# EasyEDA Pro project 05_立创eda专业版_esp32语音助手-电池版_2024-09-18.epro

# Schematic esp32语音助手-电池版

## Sheets
1 esp32_mini: Board Name: 05_语音板-天问_电池; Create Date: 2024-08-17; Page Name: esp32_mini; Project Name: esp32语音助手-自制版; Schematic Name: Schematic1_3; Update Date: 2024-09-04
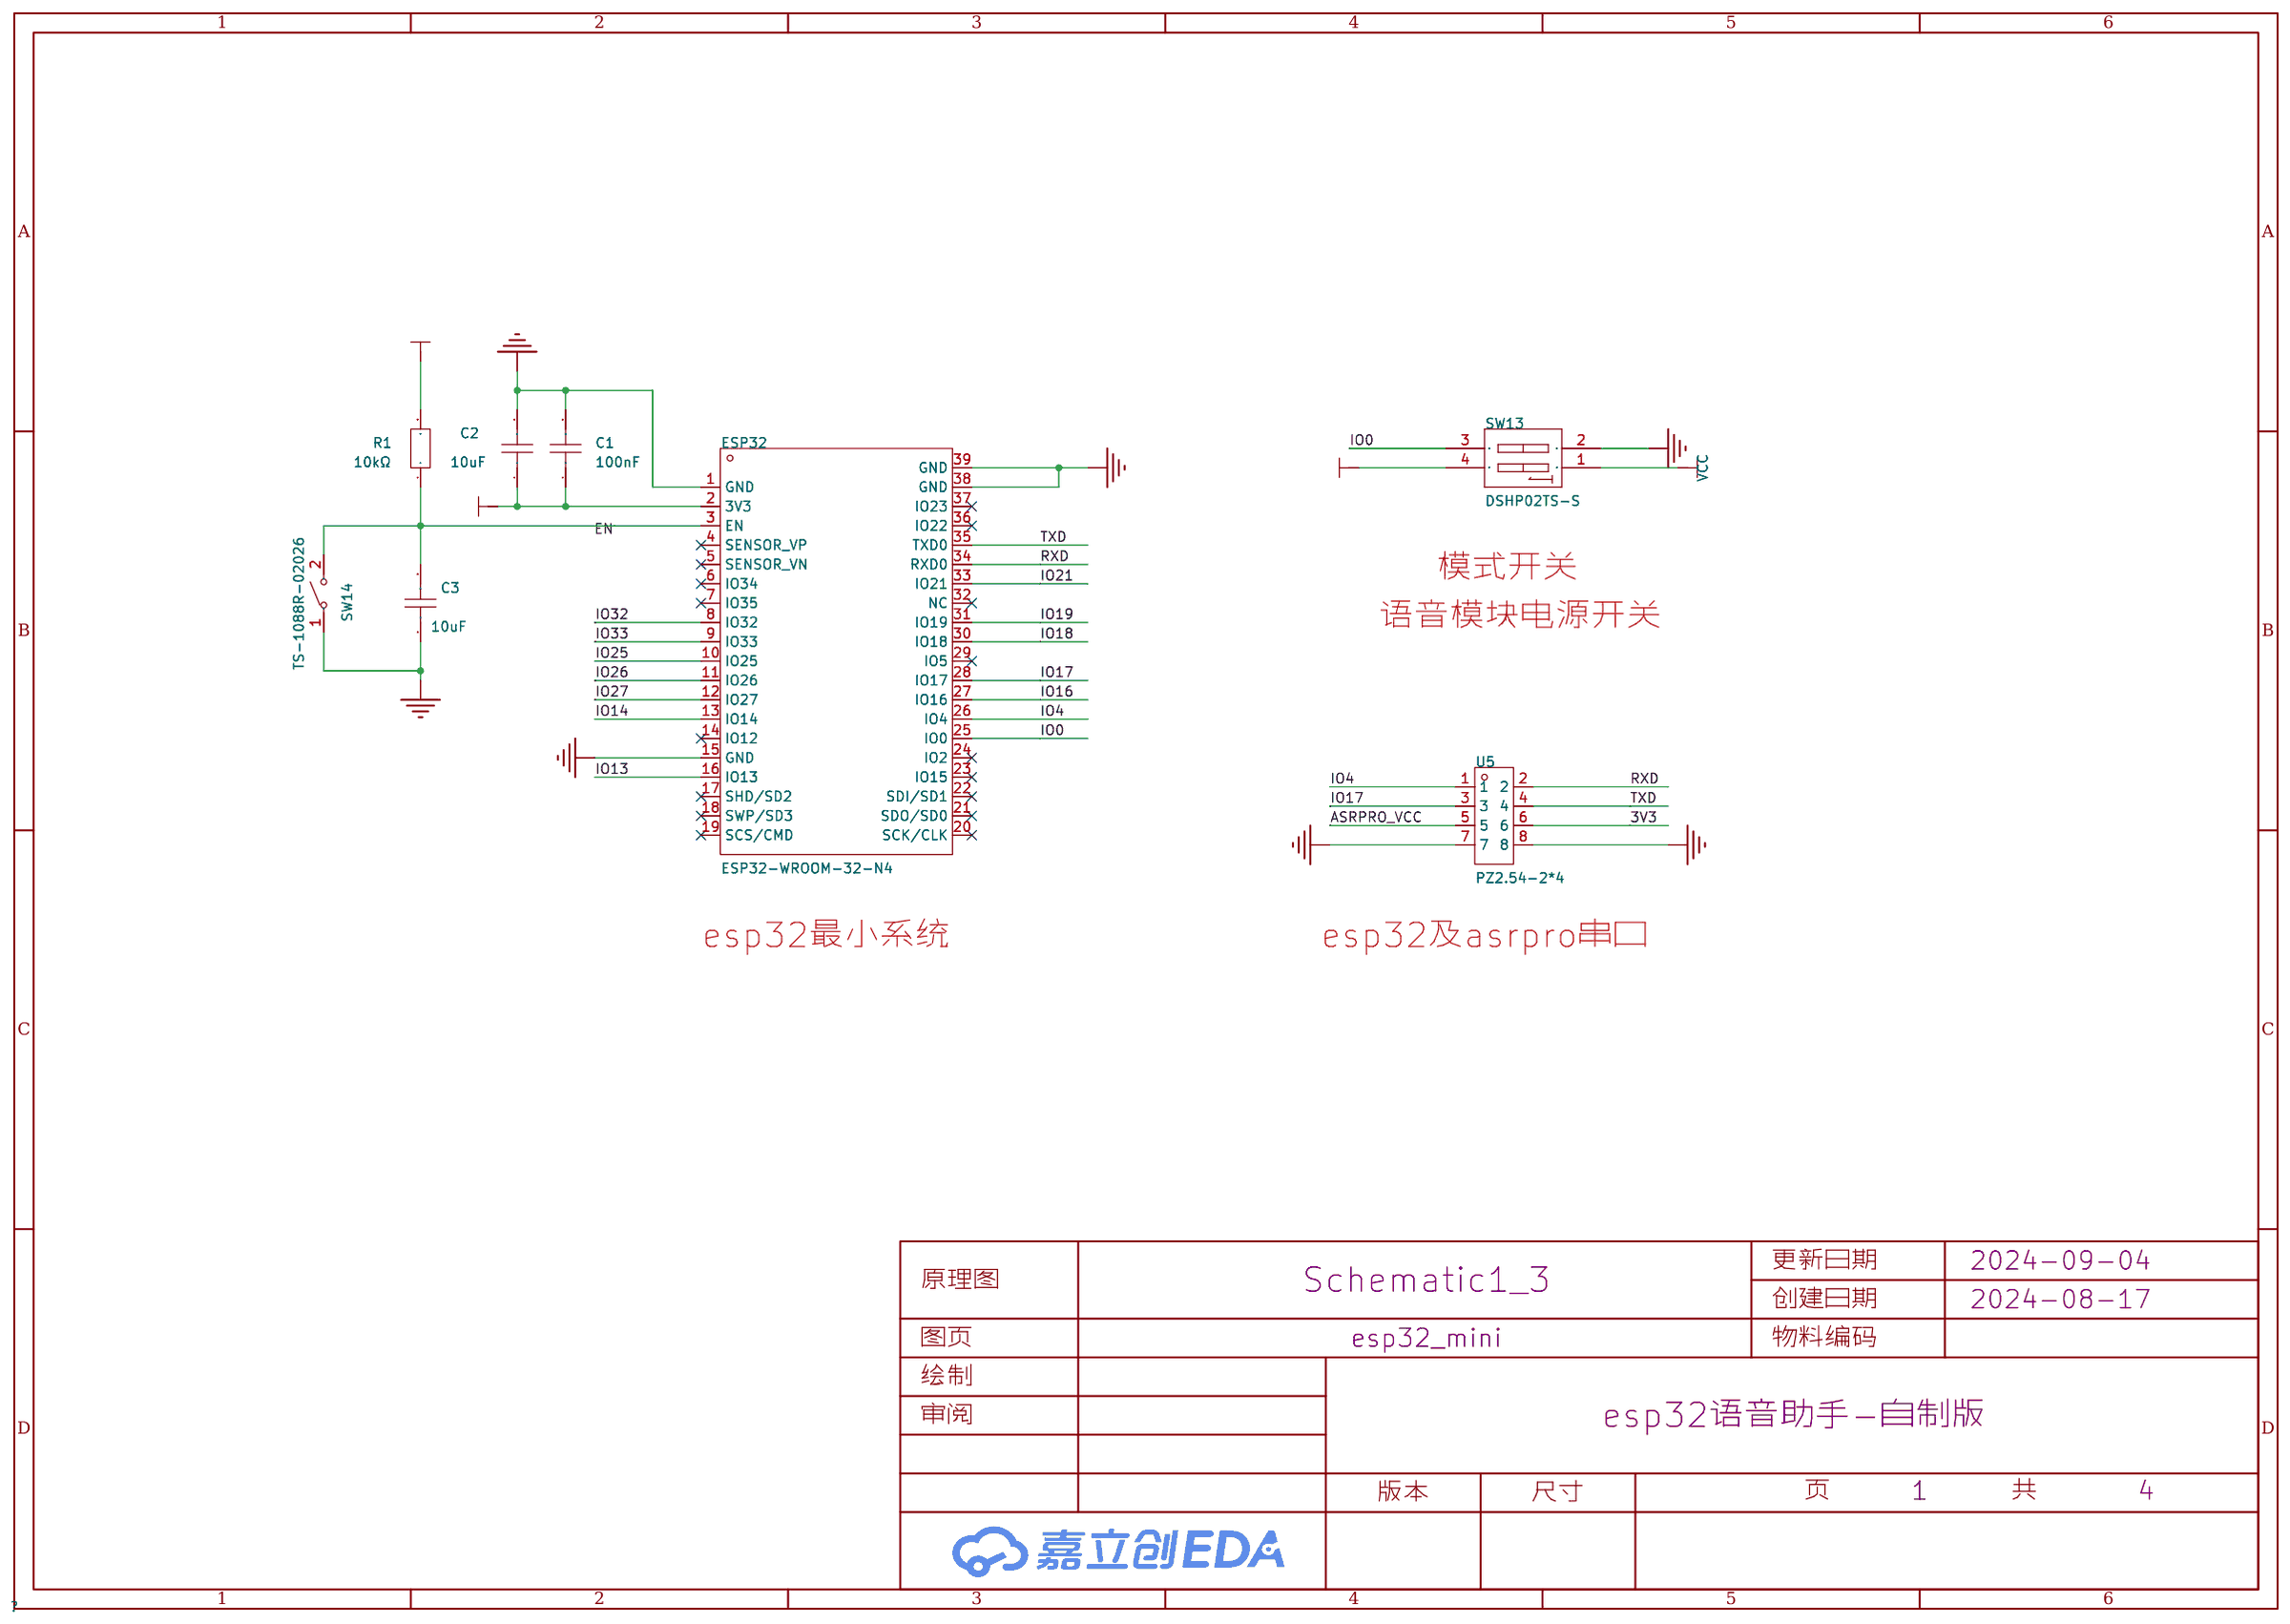
[diagram p0: esp32_mini]
2 twen: Page Name: twen; Update Date: 2024-09-03
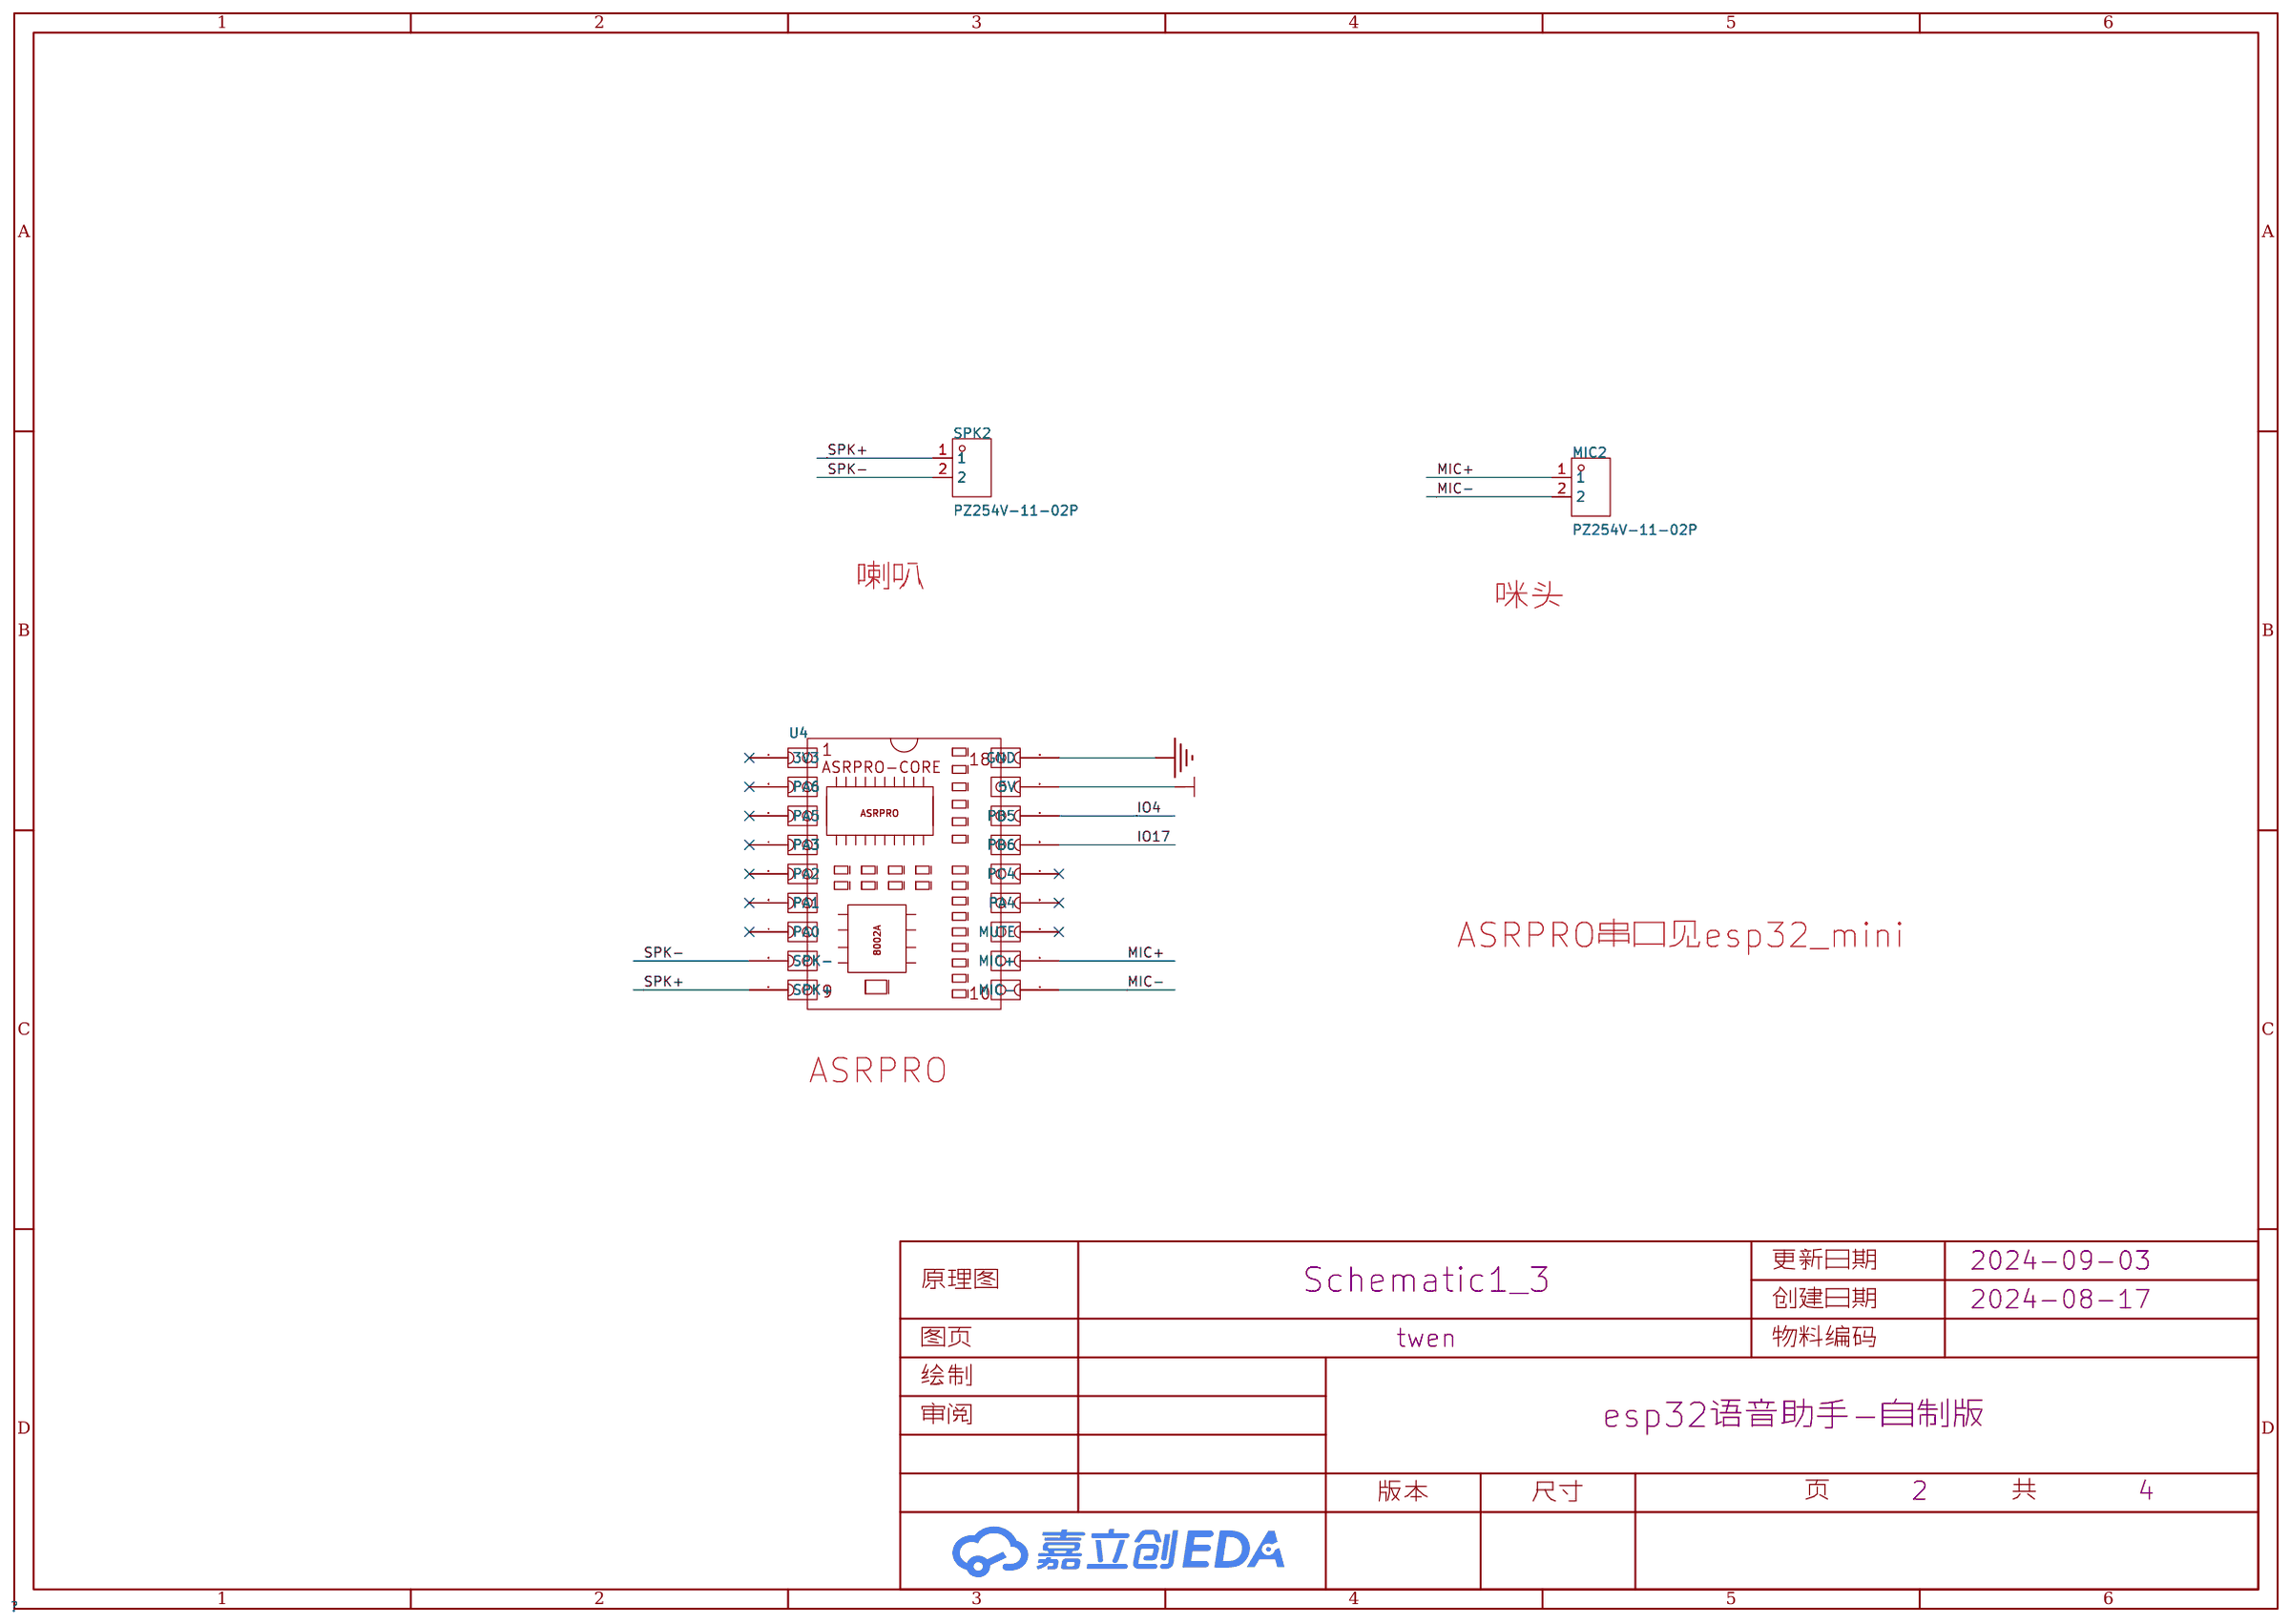
[diagram p1: twen]
3 inandout: Page Name: inandout; Update Date: 2024-09-03
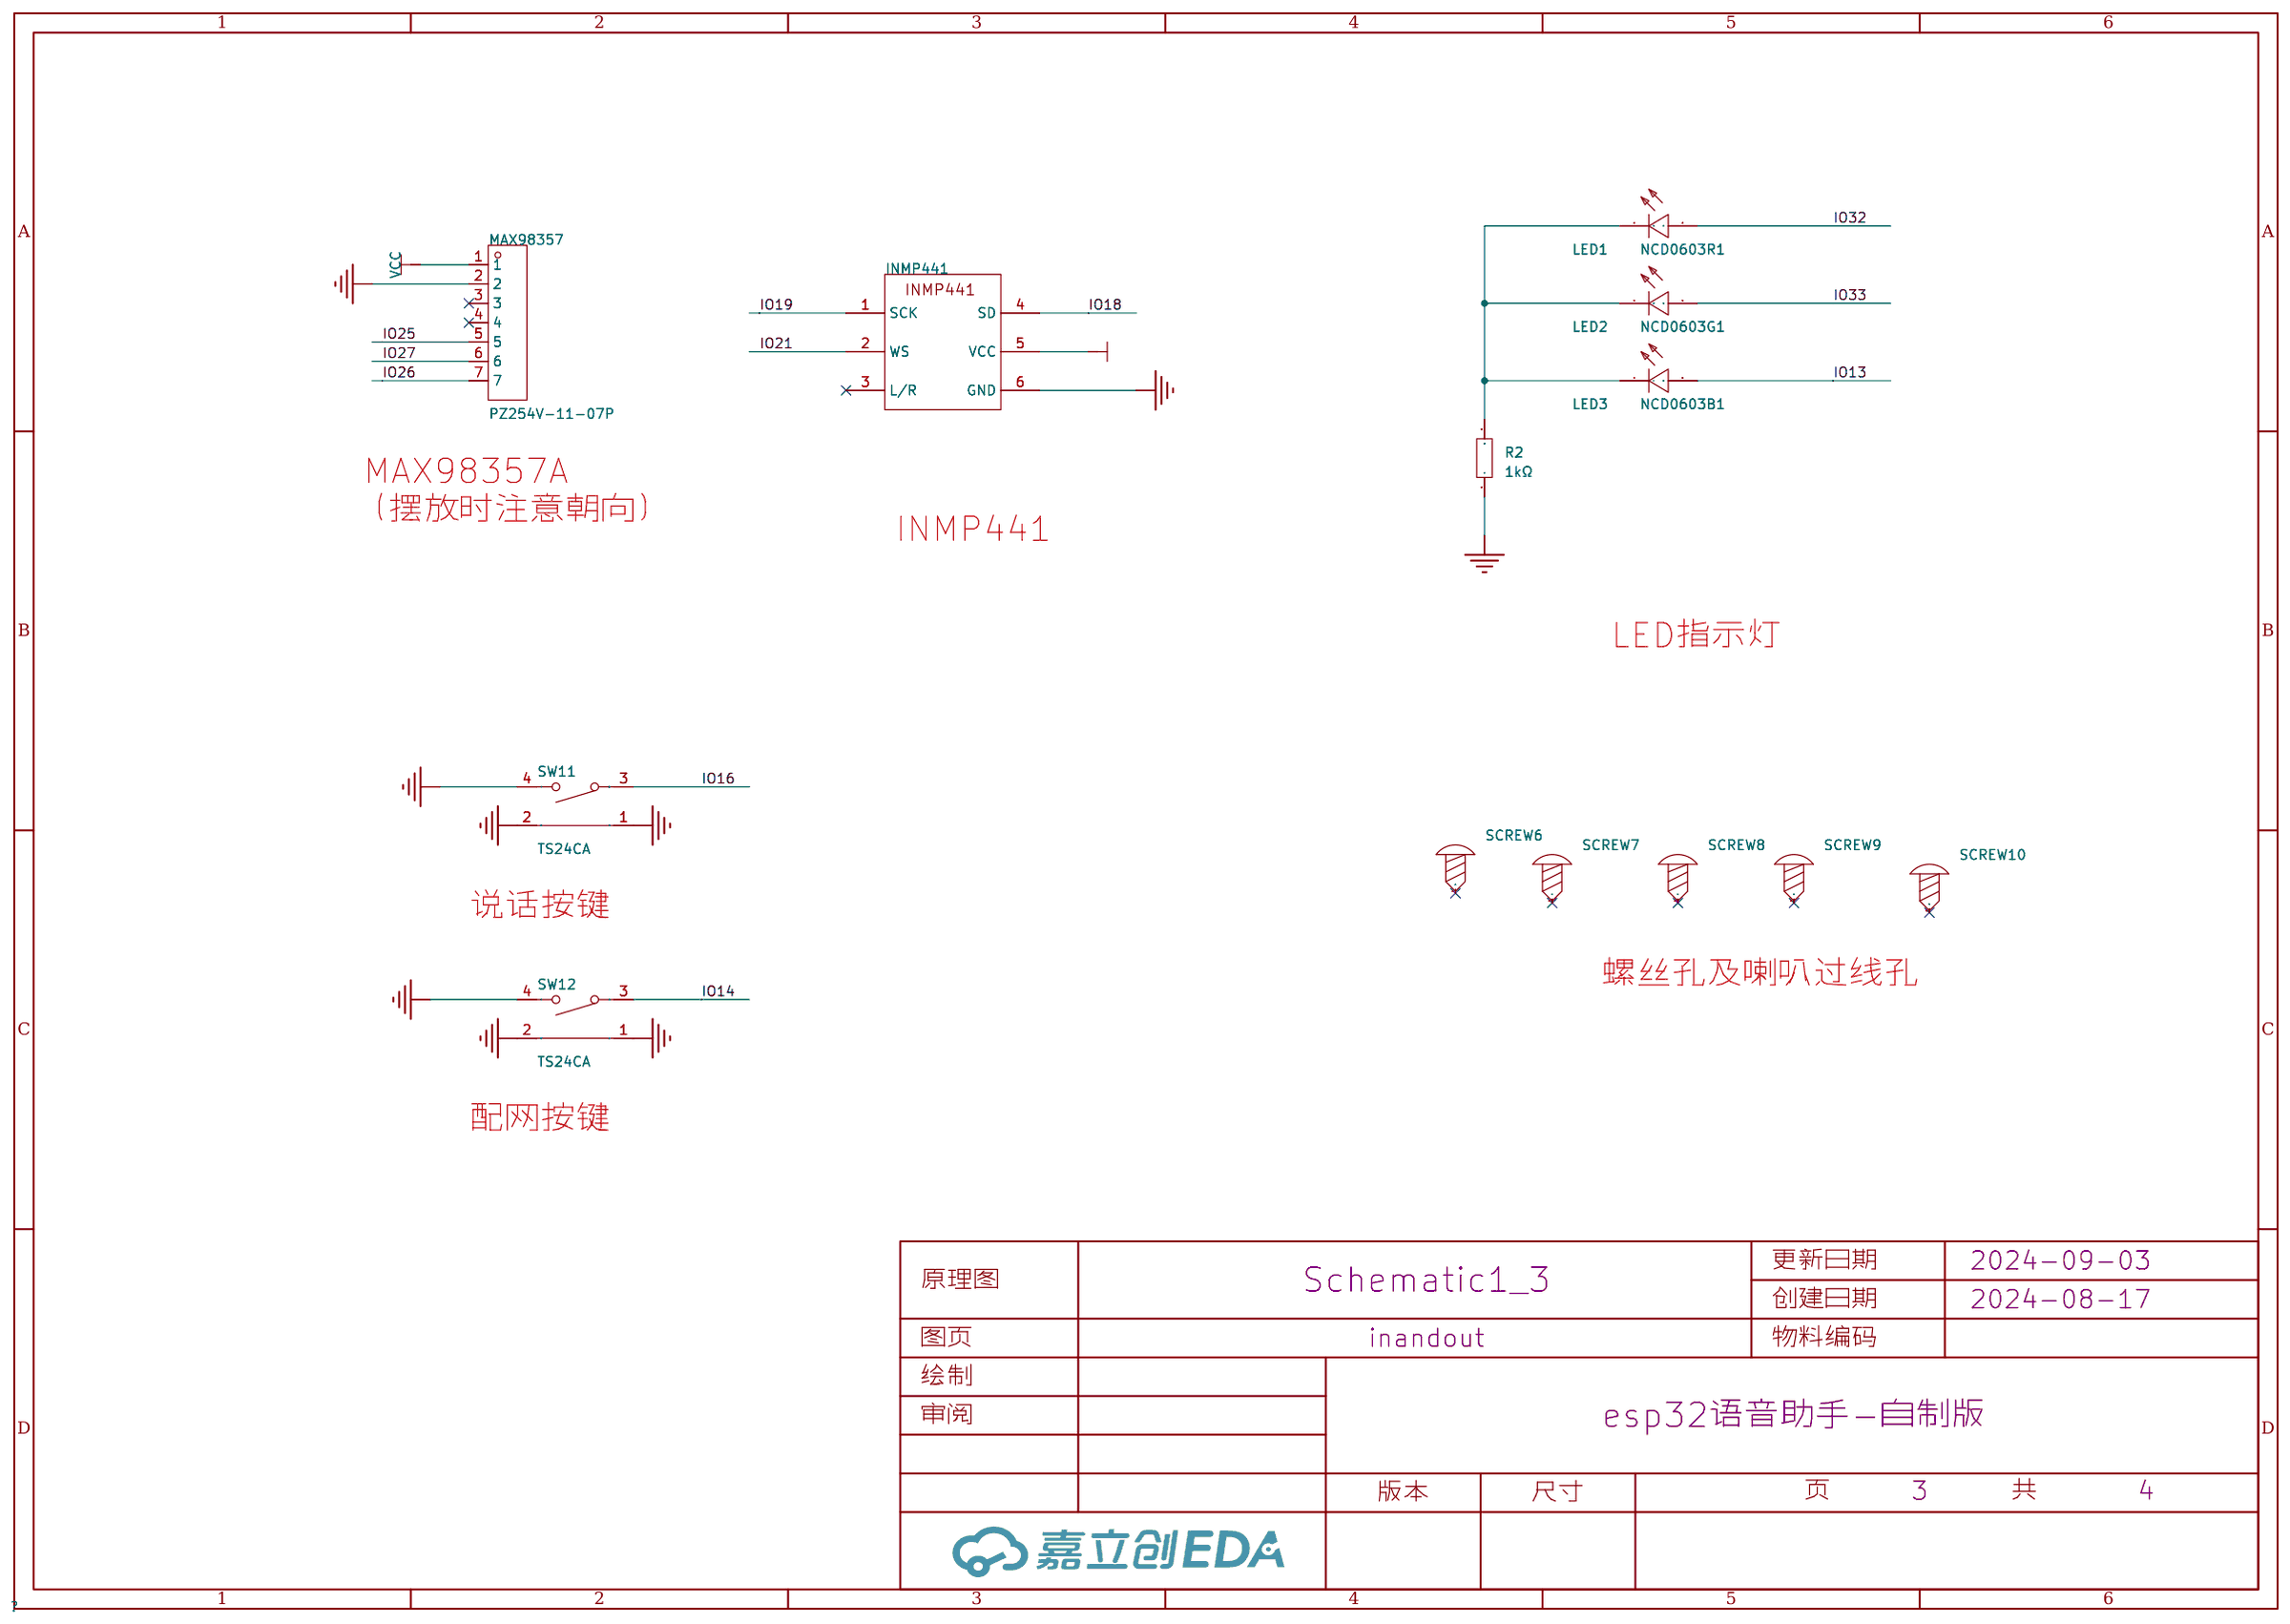
[diagram p2: inandout]
4 power: Page Name: power; Update Date: 2024-09-03
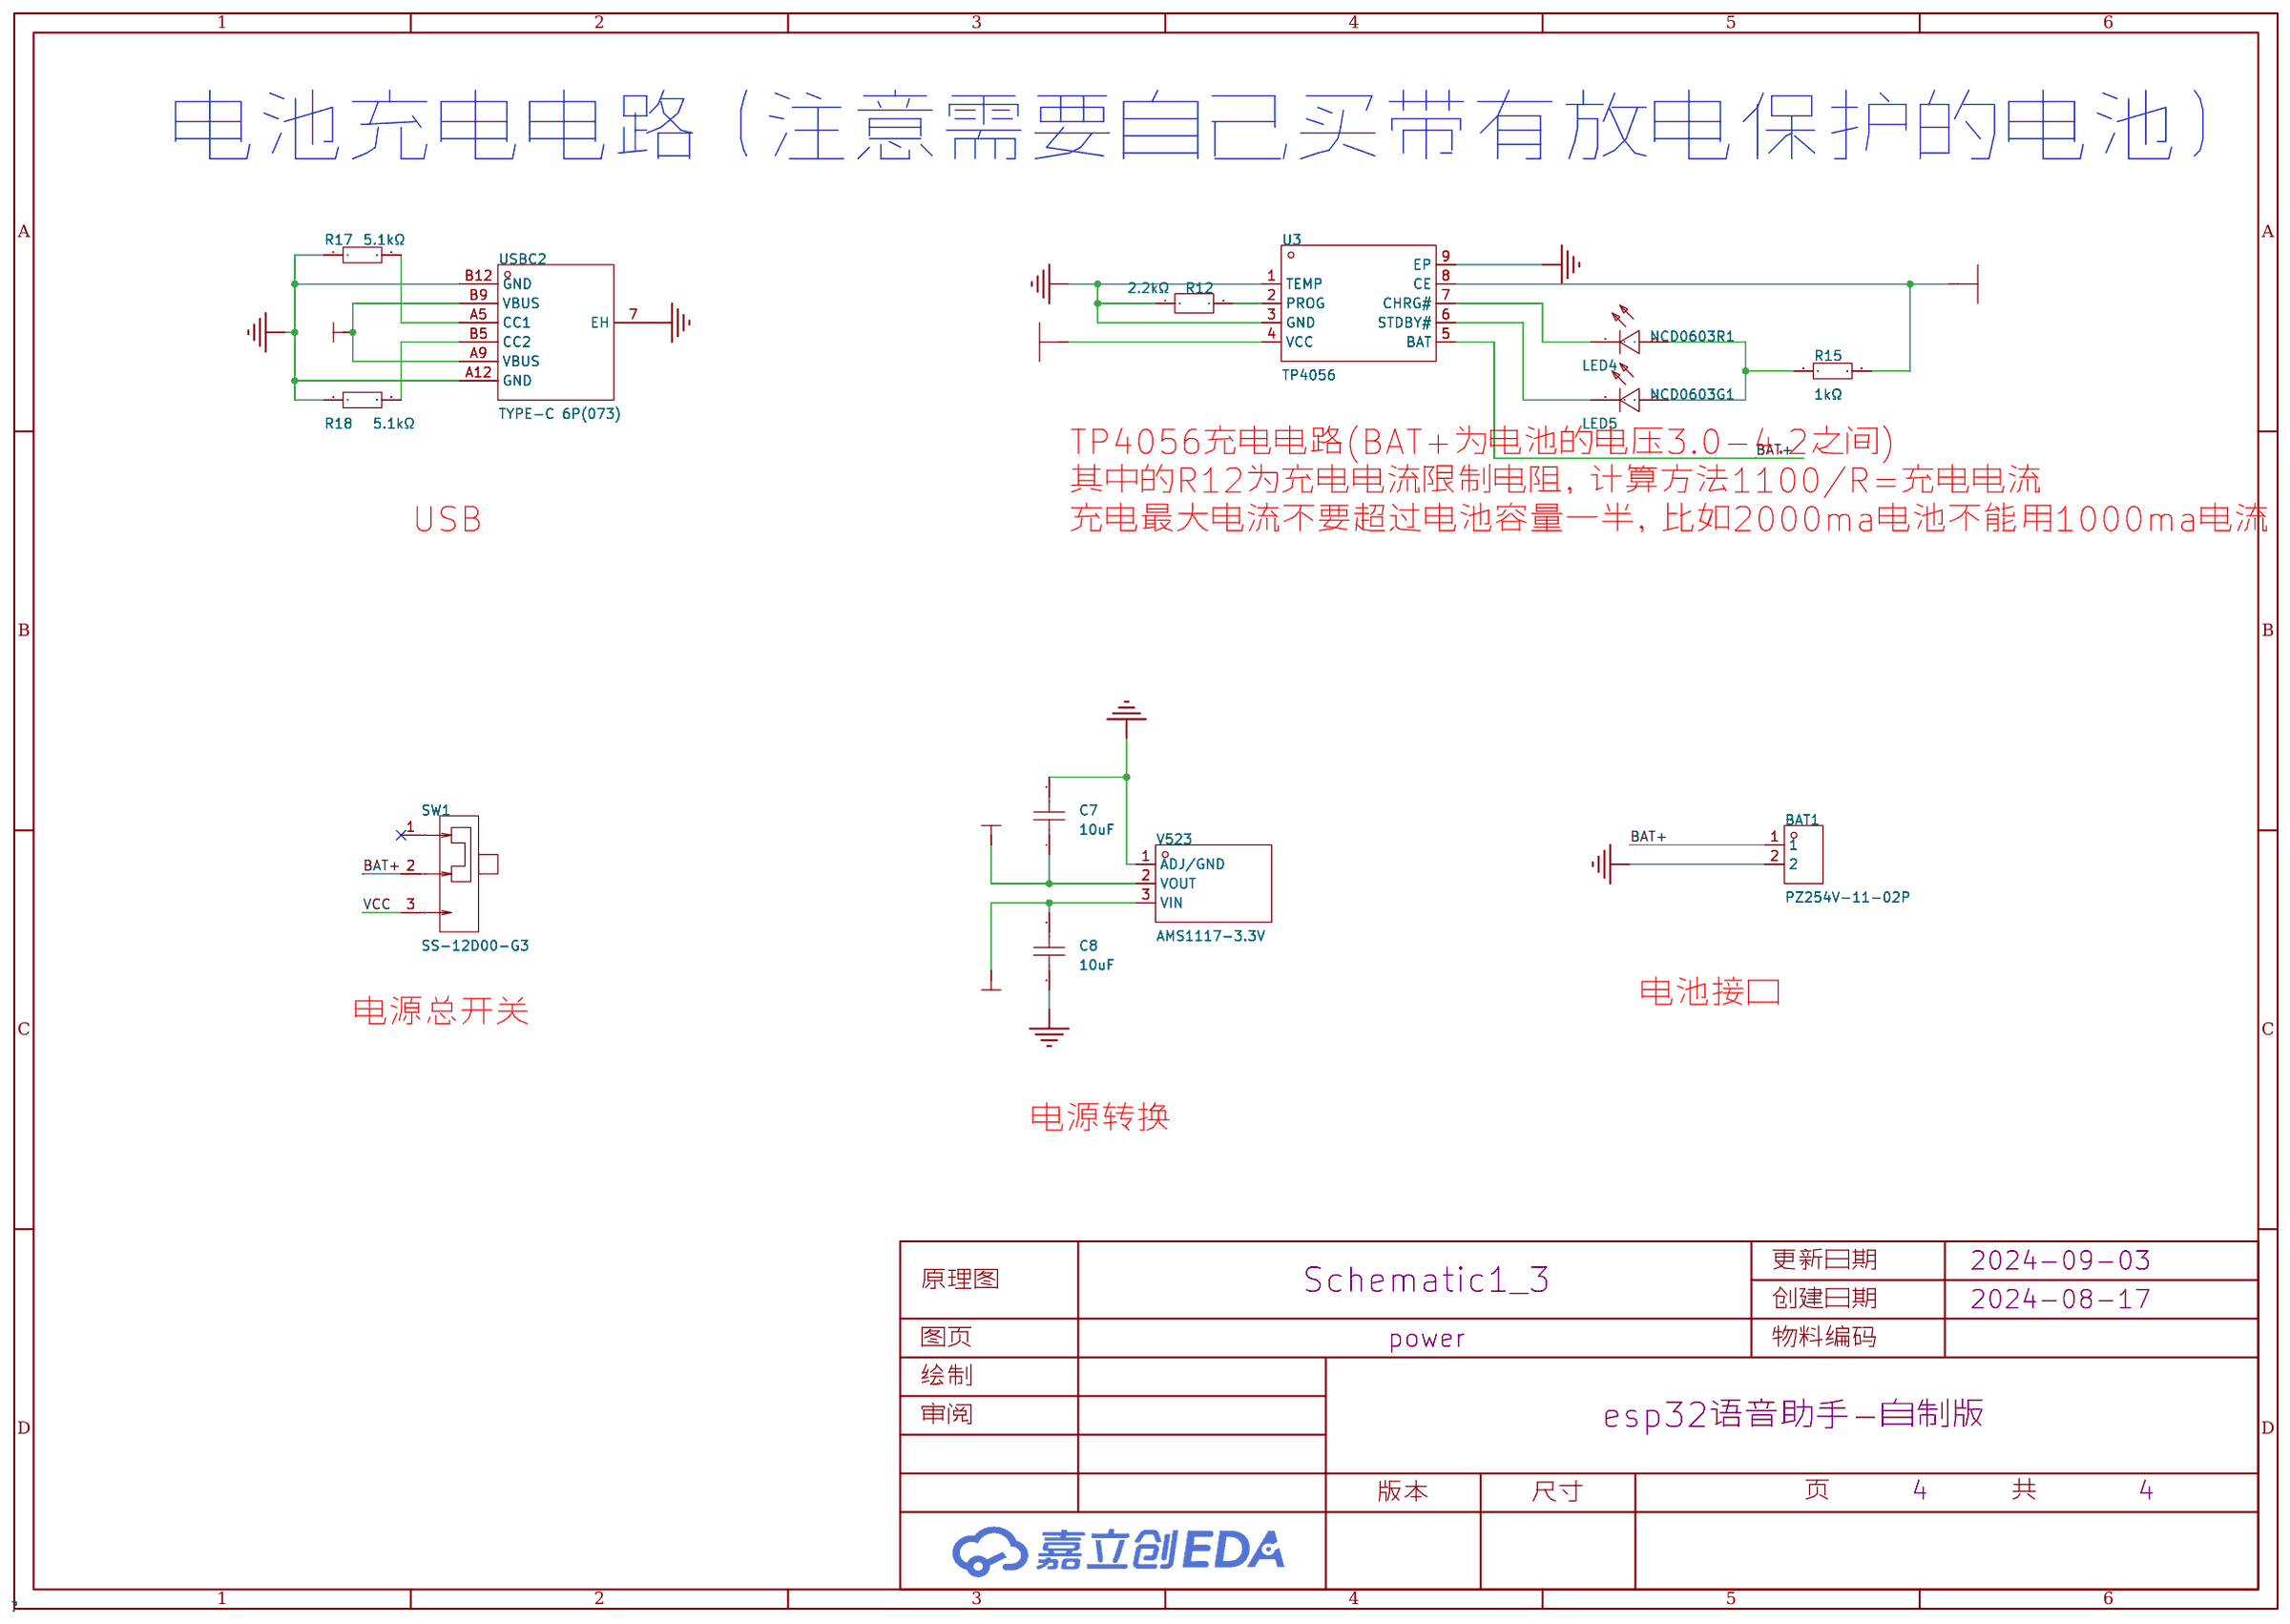
[diagram p3: power]

## Parts
sheet esp32_mini
C1  100nF  [C0603]
C2  10uF  [C0603]
C3  10uF  [C0603]
ESP32  ESP32-WROOM-32-N4  [WIFIM-SMD_ESP32-WROOM-32-N4]
R1  10kΩ  [R0603]
SW13  DSHP02TS-S  [SW-SMD_DSHP02TS-S_1]
SW14  TS-1088R-02026  [SW-SMD_L3.9-W3.0-P4.45]
U5  PZ2.54-2*4  [HDR-TH_8P-P2.54-V-M-R2-C4-S2.54]
sheet inandout
INMP441  -  [INMP441]
LED1  NCD0603R1  [LED0603-RD_RED]
LED2  NCD0603G1  [LED0603-RD]
LED3  NCD0603B1  [LED0603-RD]
MAX98357  PZ254V-11-07P  [HDR-TH_7P-P2.54-V-M]
R2  1kΩ  [R0603]
SCREW6  -  [M2螺丝]
SCREW7  -  [M2螺丝]
SCREW8  -  [M2螺丝]
SCREW9  -  [M2螺丝]
SCREW10  -  [M2螺丝]
SW11  TS24CA  [SW-SMD_TS24CA]
SW12  TS24CA  [SW-SMD_TS24CA]
sheet power
BAT1  PZ254V-11-02P  [HDR-TH_2P-P2.54-V-M]
C7  10uF  [C0603]
C8  10uF  [C0603]
LED4  NCD0603R1  [LED0603-RD_RED]
LED5  NCD0603G1  [LED0603-RD]
R12  2.2kΩ  [R0603]
R15  1kΩ  [R0603]
R17  5.1kΩ  [R0603]
R18  5.1kΩ  [R0603]
SW1  SS-12D00-G3  [SW-TH_SS-12D00-G3]
U3  TP4056  [ESOP-8_L4.9-W3.9-P1.27-LS6.0-BL-EP]
USBC2  TYPE-C 6P(073)  [TYPE-C-SMD_TYPE-C-6P_5]
V523  AMS1117-3.3V  [SOT-89-3_L4.5-W2.5-P1.50-LS4.2-BR]
sheet twen
MIC2  PZ254V-11-02P  [HDR-TH_2P-P2.54-V-M]
SPK2  PZ254V-11-02P  [HDR-TH_2P-P2.54-V-M]
U4  -  [ASRPRO-CORE-1]

## Library data of the parts
C1 = CC0603KRX7R9BB104: 容值:100nF;精度:±10%;额定电压:50V;材质(温度系数):X7R;; LCSC Part Name: 100nF ±10% 50V; Supplier Part: C14663; Manufacturer: YAGEO(国巨); Supplier Footprint: 0603; JLCPCB Part Class: 基础库; Datasheet: https://atta.szlcsc.com/upload/public/pdf/source/20180910/C282072_33301C7F631E79921B82A8DAC6BCC5B3.pdf; Supplier: LCSC; Tolerance: ±10%; Voltage Rated: 50V; Temperature Coefficient: X7R
C2 C3 = CL10A106MA8NRNC: 容值:10uF;精度:±20%;额定电压:25V;材质(温度系数):X5R;; LCSC Part Name: 10uF ±20% 25V; Supplier Part: C96446; Manufacturer: SAMSUNG(三星); Supplier Footprint: 0603; JLCPCB Part Class: 基础库; Datasheet: https://atta.szlcsc.com/upload/public/pdf/source/20160218/1457707763339.pdf; Supplier: LCSC; Tolerance: ±20%; Voltage Rated: 25V; Temperature Coefficient: X5R
ESP32 = ESP32-WROOM-32-N4: WiFi+蓝牙4.2+双核CPU,ESP32; LCSC Part Name: WiFi+蓝牙4.2+双核CPU模块; Supplier Part: C82899; Manufacturer: ESPRESSIF(乐鑫); Supplier Footprint: SMD,18x25.5mm; JLCPCB Part Class: 扩展库; Datasheet: https://atta.szlcsc.com/upload/public/pdf/source/20210719/C82899_2D52724B6FAFABC419BCF308C5944296.pdf; Supplier: LCSC
R1 = FRC0603J103TS: 电阻类型:厚膜电阻;阻值:10kΩ;精度:±5%;功率:100mW;最大工作电压:75V;温度系数:±100ppm/℃;; LCSC Part Name: 10kΩ ±5% 100mW 厚膜电阻; Supplier Part: C2930027; Manufacturer: FOJAN(富捷); Supplier Footprint: 0603; JLCPCB Part Class: 扩展库; Datasheet: https://atta.szlcsc.com/upload/public/pdf/source/20211221/925EC7D7225764EE0046F22065062C87.pdf; Supplier: LCSC; Type: 厚膜电阻; Tolerance: ±5%; Power(Watts): 100mW; Overload Voltage (Max): 75V; Temperature Coefficient: ±100ppm/℃; Operating Temperature Range: -55℃~+155℃
SW13 = DSHP02TS-S: 类型:平拨,凹槽式;电路结构:单刀单掷;开关位数:2位;额定电流:25mA;额定电压:24V;使用寿命:3千次;颜色:黑色;; LCSC Part Name: 间距1.27mm 平拨,凹槽式 2位拨码开关; Supplier Part: C319052; Manufacturer: XKB Connectivity(中国星坤); Supplier Footprint: SMD-4P,4.1x5.4mm; JLCPCB Part Class: 扩展库; Datasheet: https://atta.szlcsc.com/upload/public/pdf/source/20211009/11BE85C99D2C85B0991AF4F9D6EB8BDE.pdf; Supplier: LCSC; Type: 平拨,凹槽式; Circuit: 单刀单掷; Number of Positions: 2位; Pin Style: 鸥翼型; Lead Pitch: 1.27mm; Current Rating: 25mA; Voltage Rating: 24V; Operating Temperature: -20℃~+70℃; Operating Life: 3千次; Color: 黑色
SW14 = TS-1088R-02026: 电路结构:单刀单掷;按钮形状:圆形按钮;安装方式:立贴;开关长度:3.9mm;开关宽度:2.93mm;开关高度:2mm;触点电流:50mA;额定电压(DC):12V;带灯:-;机械寿命:-;; LCSC Part Name: 3.9*2.93*2mm 立贴 轻触开关; Supplier Part: C455280; Manufacturer: XUNPU(讯普); Supplier Footprint: SMD,3x4mm; JLCPCB Part Class: 扩展库; Datasheet: https://atta.szlcsc.com/upload/public/pdf/source/20191118/C455281_EC5379764BC1462550DF64BBBFEA9579.pdf; Supplier: LCSC; Circuit: 单刀单掷; Actuator Style: 圆形按钮; Mounting Style: 立贴; Switch Length: 3.9mm; Switch Width: 2.93mm; Switch Height: 2mm; Contact Current: 50mA; Voltage Rating (DC): 12V
U5 = PZ2.54-2*4: 插针结构:2x4P;间距:2.54mm;排数:双排;总PIN位数:8P;; Supplier Part: C5156676; Manufacturer: ZHOURI(洲日); Supplier Footprint: 插件,P=2.54mm; JLCPCB Part Class: 扩展库; Datasheet: https://atta.szlcsc.com/upload/public/pdf/source/20220923/0E7A4A94740FFD503E2D73F36F92C1EA.pdf; Supplier: LCSC; Pin Structure: 2x4P; Pitch: 2.54mm; Number of Rows: 双排; Number of Pins: 8P
INMP441 = inmp441
LED1 LED4 = NCD0603R1_C84263: 灯头类型:-;发光颜色:红色;正向电压(VF):1.6V~2.6V;功率:65mW;正向电流:20mA;主波长:615nm~630nm;二极管配置:独立二极管;透镜颜色:无色透明透镜;色温:-;发光强度:80mcd~220mcd;发光角度:130°;载带方式:-;工作温度:-30℃~+85℃;; Supplier Part: C84263; Manufacturer: 国星光电; Supplier Footprint: 0603; JLCPCB Part Class: 扩展库; Datasheet: https://atta.szlcsc.com/upload/public/pdf/source/20200820/C84263_DABC6A75E58F576973B407FDBA283D60.pdf; Supplier: LCSC; Emitted Color: 红色; Forward Voltage (VF): 1.6V~2.6V; Power Dissipation: 65mW; Forward Current: 20mA; Dominant Wavelength: 615nm~630nm; Diode Configuration: 独立二极管; Lens Color: 无色透明透镜; Luminous Intensity: 80mcd~220mcd; Viewing Angle: 130°; Operating Temperature: -30℃~+85℃
LED2 LED5 = NCD0603G1: 发光颜色:翠绿色;正向电压(VF):2.6V~3.6V;功率:72mW;正向电流:10mA;主波长:515nm~530nm;透镜颜色:无色透明透镜;发光强度:330mcd~900mcd;发光角度:130°;工作温度:-30℃~+85℃;; Supplier Part: C84267; Manufacturer: 国星光电; Supplier Footprint: 0603; JLCPCB Part Class: 扩展库; Datasheet: https://atta.szlcsc.com/upload/public/pdf/source/20200820/C84267_04BA7703640BAC111D09F5EFB971FBF3.pdf; Supplier: LCSC; Emitted Color: 翠绿色; Forward Voltage (VF): 2.6V~3.6V; Power Dissipation: 72mW; Forward Current: 10mA; Dominant Wavelength: 515nm~530nm; Lens Color: 无色透明透镜; Luminous Intensity: 330mcd~900mcd; Viewing Angle: 130°; Operating Temperature: -30℃~+85℃; Check: false
LED3 = NCD0603B1: 发光颜色:蓝色;正向电压(VF):2.6V~3.6V;功率:72mW;正向电流:10mA;主波长:463nm~475nm;透镜颜色:无色透明透镜;发光强度:80mcd~220mcd;发光角度:130°;工作温度:-30℃~+85℃;; Supplier Part: C84266; Manufacturer: 国星光电; Supplier Footprint: 0603; JLCPCB Part Class: 扩展库; Datasheet: https://atta.szlcsc.com/upload/public/pdf/source/20200820/C84266_6A3CDBEFA72C6CAD68EDA53474ADAE6C.pdf; Supplier: LCSC; Emitted Color: 蓝色; Forward Voltage (VF): 2.6V~3.6V; Power Dissipation: 72mW; Forward Current: 10mA; Dominant Wavelength: 463nm~475nm; Lens Color: 无色透明透镜; Luminous Intensity: 80mcd~220mcd; Viewing Angle: 130°; Operating Temperature: -30℃~+85℃
MAX98357 = PZ254V-11-07P: 插针结构:1x7P;间距:2.54mm;行距:-;圆针/方针:方针;安装类型:直插;排数:单排;总PIN位数:7P;额定电流:-;额定电压:-;配合针长度:6mm;塑高:2.5mm;端接针长度:3mm;触头材质:黄铜;触头镀层:-;工作温度范围:-40℃~+105℃;颜色:黑色;; LCSC Part Name: 间距:2.54mm 1x7P 直插 方针; Supplier Part: C492406; Manufacturer: XFCN(兴飞); Supplier Footprint: 插件,P=2.54mm; JLCPCB Part Class: 扩展库; Datasheet: https://atta.szlcsc.com/upload/public/pdf/source/20200309/C492406_654C533EE691117E22DD9F76C114C2D9.pdf; Supplier: LCSC; Pin Structure: 1x7P; Pitch: 2.54mm; Circluar Pins/Square Pins: 方针; Mounting Type: 直插; Number of Rows: 单排; Number of Pins: 7P; Length of Mating Pin: 6mm; Insulation Height: 2.5mm; Length of End Connection Pin: 3mm; Contact Material: 黄铜; Operating Temperature Range: -40℃~+105℃; Color: 黑色
R2 R15 = RC0603FR-071KL: 电阻类型:厚膜电阻;阻值:1kΩ;精度:±1%;功率:100mW;最大工作电压:75V;温度系数:±100ppm/℃;; LCSC Part Name: 厚膜电阻 1kΩ ±1% 100mW; Supplier Part: C22548; Manufacturer: YAGEO(国巨); Supplier Footprint: 0603; JLCPCB Part Class: 扩展库; Datasheet: https://atta.szlcsc.com/upload/public/pdf/source/20180316/70C0E2BDAE7FCC62C531A5A58D202EE1.pdf; Supplier: LCSC; Type: 厚膜电阻; Tolerance: ±1%; Power(Watts): 100mW; Overload Voltage (Max): 75V; Temperature Coefficient: ±100ppm/℃; Operating Temperature Range: -55℃~+155℃
SCREW6-SCREW10 = M2螺丝: Supplier Footprint: 插件
SW11 SW12 = TS24CA: 电路结构:单刀单掷;按钮形状:矩形按钮;安装方式:卧贴;开关长度:4.55mm;开关宽度:1.8mm;开关高度:3.5mm;触点电流:50mA;额定电压(DC):12V;带灯:-;机械寿命:-;; LCSC Part Name: 4.55*1.8*3.5mm 卧贴 轻触开关; Supplier Part: C393942; Manufacturer: SHOU HAN(首韩); Supplier Footprint: SMD; JLCPCB Part Class: 扩展库; Datasheet: https://atta.szlcsc.com/upload/public/pdf/source/20190521/C393942_591A9E318887EFA4274D34029981AD99.pdf; Supplier: LCSC; Circuit: 单刀单掷; Actuator Style: 矩形按钮; Mounting Style: 卧贴; Switch Length: 4.55mm; Switch Width: 1.8mm; Switch Height: 3.5mm; Contact Current: 50mA; Voltage Rating (DC): 12V
BAT1 MIC2 SPK2 = PZ254V-11-02P: 插针结构:1x2P;间距:2.54mm;行距:-;圆针/方针:方针;安装类型:直插;排数:单排;总PIN位数:2P;额定电流:-;额定电压:-;配合针长度:6mm;塑高:2.5mm;端接针长度:3mm;触头材质:黄铜;触头镀层:-;工作温度范围:-40℃~+105℃;颜色:黑色;; LCSC Part Name: 间距:2.54mm 1x2P 直插 方针; Supplier Part: C492401; Manufacturer: XFCN(兴飞); Supplier Footprint: 插件,P=2.54mm; JLCPCB Part Class: 扩展库; Datasheet: https://atta.szlcsc.com/upload/public/pdf/source/20200309/C492401_A812433581A9B211A7FFA413ADDFF0E5.pdf; Supplier: LCSC; Pin Structure: 1x2P; Pitch: 2.54mm; Circluar Pins/Square Pins: 方针; Mounting Type: 直插; Number of Rows: 单排; Number of Pins: 2P; Length of Mating Pin: 6mm; Insulation Height: 2.5mm; Length of End Connection Pin: 3mm; Contact Material: 黄铜; Operating Temperature Range: -40℃~+105℃; Color: 黑色
C7 C8 = CL10A106KP8NNNC: 容值:10uF;精度:±10%;额定电压:10V;材质(温度系数):X5R;; LCSC Part Name: 10uF ±10% 10V; Supplier Part: C19702; Manufacturer: SAMSUNG(三星); Supplier Footprint: 0603; JLCPCB Part Class: 基础库; Datasheet: https://atta.szlcsc.com/upload/public/pdf/source/20160218/1457707763339.pdf; Supplier: LCSC; Tolerance: ±10%; Voltage Rated: 10V; Temperature Coefficient: X5R
R12 = FRC0603J222 TS: 电阻类型:厚膜电阻;阻值:2.2kΩ;精度:±5%;功率:100mW;最大工作电压:75V;温度系数:±100ppm/℃;; LCSC Part Name: 2.2kΩ ±5% 100mW 厚膜电阻; Supplier Part: C2907117; Manufacturer: FOJAN(富捷); Supplier Footprint: 0603; JLCPCB Part Class: 扩展库; Datasheet: https://atta.szlcsc.com/upload/public/pdf/source/20211221/925EC7D7225764EE0046F22065062C87.pdf; Supplier: LCSC; Type: 厚膜电阻; Tolerance: ±5%; Power(Watts): 100mW; Overload Voltage (Max): 75V; Temperature Coefficient: ±100ppm/℃; Operating Temperature Range: -55℃~+155℃
R17 R18 = 0603WAF5101T5E: 电阻类型:厚膜电阻;阻值:5.1kΩ;精度:±1%;功率:100mW;最大工作电压:75V;温度系数:±100ppm/℃;; LCSC Part Name: 5.1kΩ ±1% 100mW 厚膜电阻; Supplier Part: C23186; Manufacturer: UNI-ROYAL(厚声); Supplier Footprint: 0603; JLCPCB Part Class: 基础库; Datasheet: https://atta.szlcsc.com/upload/public/pdf/source/20200306/C422600_1E6D84923E4A46A82E41ADD87F860B5C.pdf; Supplier: LCSC; Type: 厚膜电阻; Tolerance: ±1%; Power(Watts): 100mW; Overload Voltage (Max): 75V; Temperature Coefficient: ±100ppm/℃; Operating Temperature Range: -55℃~+155℃
SW1 = SS-12D00-G3: Supplier Part: C22355741; Manufacturer: SOFNG(硕方); Supplier Footprint: 插件-3P,8.8x3.9mm; Datasheet: https://atta.szlcsc.com/upload/public/pdf/source/20240529/1037A069FE9BBCECE56007AB916D4384.pdf; Supplier: LCSC
U3 = TP4056_C725790: Supplier Part: C725790; Manufacturer: UMW(友台半导体); Supplier Footprint: ESOP-8; JLCPCB Part Class: 扩展库; Datasheet: https://atta.szlcsc.com/upload/public/pdf/source/20231109/CF74897CE79A500F7FE27A45ADCCC631.pdf; Supplier: LCSC
USBC2 = TYPE-C 6P(073): 连接器类型:Type-C;标准:-;公母:母;端口数量:1;触点数量:6P;安装方式:卧贴;额定电流 - 电源:5A;工作温度范围:-25℃~+85℃;; LCSC Part Name: Type-C 母 卧贴; Supplier Part: C668623; Manufacturer: SHOU HAN(首韩); Supplier Footprint: SMD; JLCPCB Part Class: Extended Part; Datasheet: https://atta.szlcsc.com/upload/public/pdf/source/20200618/C668623_A4B260DED7AC1949BAC6AE39E9F4CD80.pdf; Supplier: LCSC; Connector Type: Type-C; Gender: 母; Number of Ports: 1; Number of Contacts: 6P; Mounting Style: 卧贴; Current Rating - Power (Max): 5A; Operating Temperature Range: -25℃~+85℃
V523 = AMS1117-3.3V_C5120796: 输出类型:固定;最大输入电压:18V;输出电压:3.3V;最大输出电流:1A;输出极性:正极;; LCSC Part Name: 输入18V 输出3.3V 1A; Supplier Part: C5120796; Manufacturer: MSKSEMI(美森科); Supplier Footprint: SOT-89; JLCPCB Part Class: 扩展库; Datasheet: https://atta.szlcsc.com/upload/public/pdf/source/20231123/6117526697EB8BF6175FDEEBA0877266.pdf; Supplier: LCSC; Output Type: 固定; Maximum Input Voltage: 18V; Output Voltage: 3.3V; MAX Output Current: 1A; Dropout Voltage: 1.4V@(1A); standby current: 12mA; Operating Temperature: 0℃~+125℃; Output Polarity: 正极; Number of Outputs: 1
U4 = ASRPRO-CORE 核心板1

## Nets
3V3: C1.1 C2.1 C7.1 ESP32.2(3V3) INMP441.5(VCC) R1.2 U5.6 V523.2(VOUT)
5VIN: R15.1 U3.4(VCC) U3.8(CE) USBC2.A9(VBUS) USBC2.B9(VBUS)
GND: BAT1.2 C1.2 C2.2 C3.1 C7.2 C8.1 ESP32.1(GND) ESP32.15(GND) ESP32.38(GND) ESP32.39(GND) INMP441.6(GND) MAX98357.2 R2.1 R12.1 R17.1 R18.1 SW11.1 SW11.2 SW11.4 SW12.1 SW12.2 SW12.4 SW13.2(A2) SW14.1 U3.1(TEMP) U3.3(GND) U3.9(EP) U4.18(GND) U5.7 U5.8 USBC2.7(EH) USBC2.A12(GND) USBC2.B12(GND) V523.1(ADJ/GND)
VCC: C8.2 MAX98357.1 SW1.3 SW13.1(A1) V523.3(VIN)
ASRPRO_VCC: SW13.4(B1) U4.17(5V) U5.5
BAT+: BAT1.1 SW1.2 U3.5(BAT)
EN: C3.2 ESP32.3(EN) R1.1 SW14.2
IO0: ESP32.25(IO0) SW13.3(B2)
IO4: ESP32.26(IO4) U4.16(PB5) U5.1
IO13: ESP32.16(IO13) LED3.2(+)
IO14: ESP32.13(IO14) SW12.3
IO16: ESP32.27(IO16) SW11.3
IO17: ESP32.28(IO17) U4.15(PB6) U5.3
IO18: ESP32.30(IO18) INMP441.4(SD)
IO19: ESP32.31(IO19) INMP441.1(SCK)
IO21: ESP32.33(IO21) INMP441.2(WS)
IO25: ESP32.10(IO25) MAX98357.5
IO26: ESP32.11(IO26) MAX98357.7
IO27: ESP32.12(IO27) MAX98357.6
IO32: ESP32.8(IO32) LED1.2(A)
IO33: ESP32.9(IO33) LED2.2(A)
MIC+: MIC2.1 U4.11(MIC+)
MIC-: MIC2.2 U4.10(MIC-)
RXD: ESP32.34(RXD0) U5.2
SPK+: SPK2.1 U4.9(SPK+)
SPK-: SPK2.2 U4.8(SPK-)
TXD: ESP32.35(TXD0) U5.4
$3N1069: LED1.1(K) LED2.1(K) LED3.1(-) R2.2
$4N4694: R18.2 USBC2.B5(CC2)
$4N4695: R17.2 USBC2.A5(CC1)
$4N4957: LED4.1(K) U3.7(CHRG#)
$4N4958: LED5.1(K) U3.6(STDBY#)
$4N4959: LED4.2(A) LED5.2(A) R15.2
$4N4961: R12.2 U3.2(PROG)

Not connected (* = marked no-connect by the designer): ESP32 4(SENSOR_VP)* 5(SENSOR_VN)* 6(IO34)* 7(IO35)* 14(IO12)* 17(SHD/SD2)* 18(SWP/SD3)* 19(SCS/CMD)* 20(SCK/CLK)* 21(SDO/SD0)* 22(SDI/SD1)* 23(IO15)* 24(IO2)* 29(IO5)* 32(NC)* 36(IO22)* 37(IO23)*; INMP441 3(L/R)*; MAX98357 3* 4*; SCREW6 1*; SCREW7 1*; SCREW8 1*; SCREW9 1*; SCREW10 1*; SW1 1*; U4 1(3V3)* 2(PA6)* 3(PA5)* 4(PA3)* 5(PA2)* 6(PA1)* 7(PA0)* 12(MUTE)* 13(PA4)* 14(PC4)*

## Notes on the sheets
sheet 1
- 模式开关
- 语音模块电源开关
- esp32最小系统
- esp32及asrpro串口
sheet 2
- 喇叭
- 咪头
- ASRPRO串口见esp32_mini
- ASRPRO
sheet 3
- MAX98357A
  （摆放时注意朝向）
- INMP441
- LED指示灯
- 说话按键
- 螺丝孔及喇叭过线孔
- 配网按键
sheet 4
- 电池充电电路（注意需要自己买带有放电保护的电池）
- USB
- TP4056充电电路(BAT+为电池的电压3.0-4.2之间)
  其中的R12为充电电流限制电阻，计算方法1100/R=充电电流
  充电最大电流不要超过电池容量一半，比如2000ma电池不能用1000ma电流
- 电源总开关
- 电池接口
- 电源转换

# Board esp32语音助手-电池版
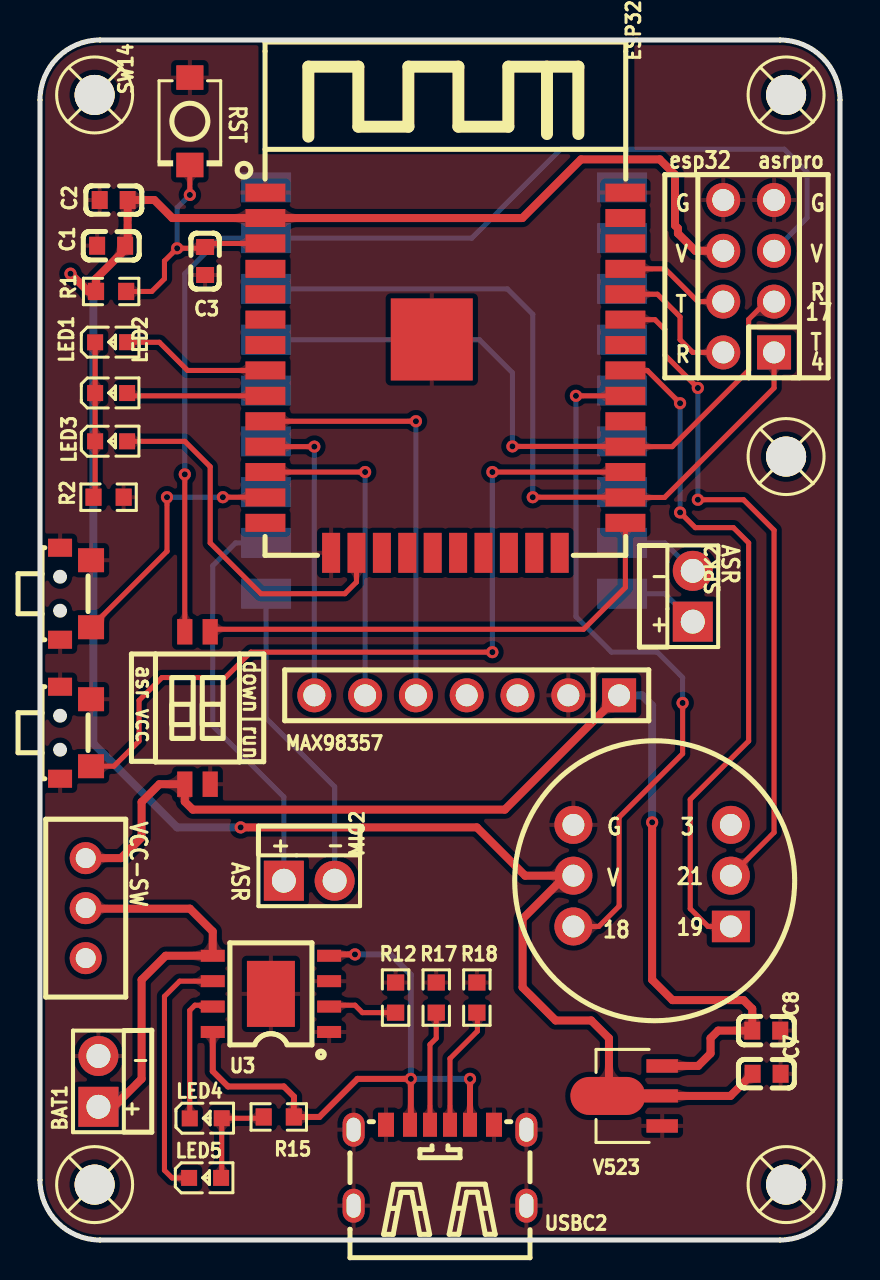
[diagram p4: board, top side]
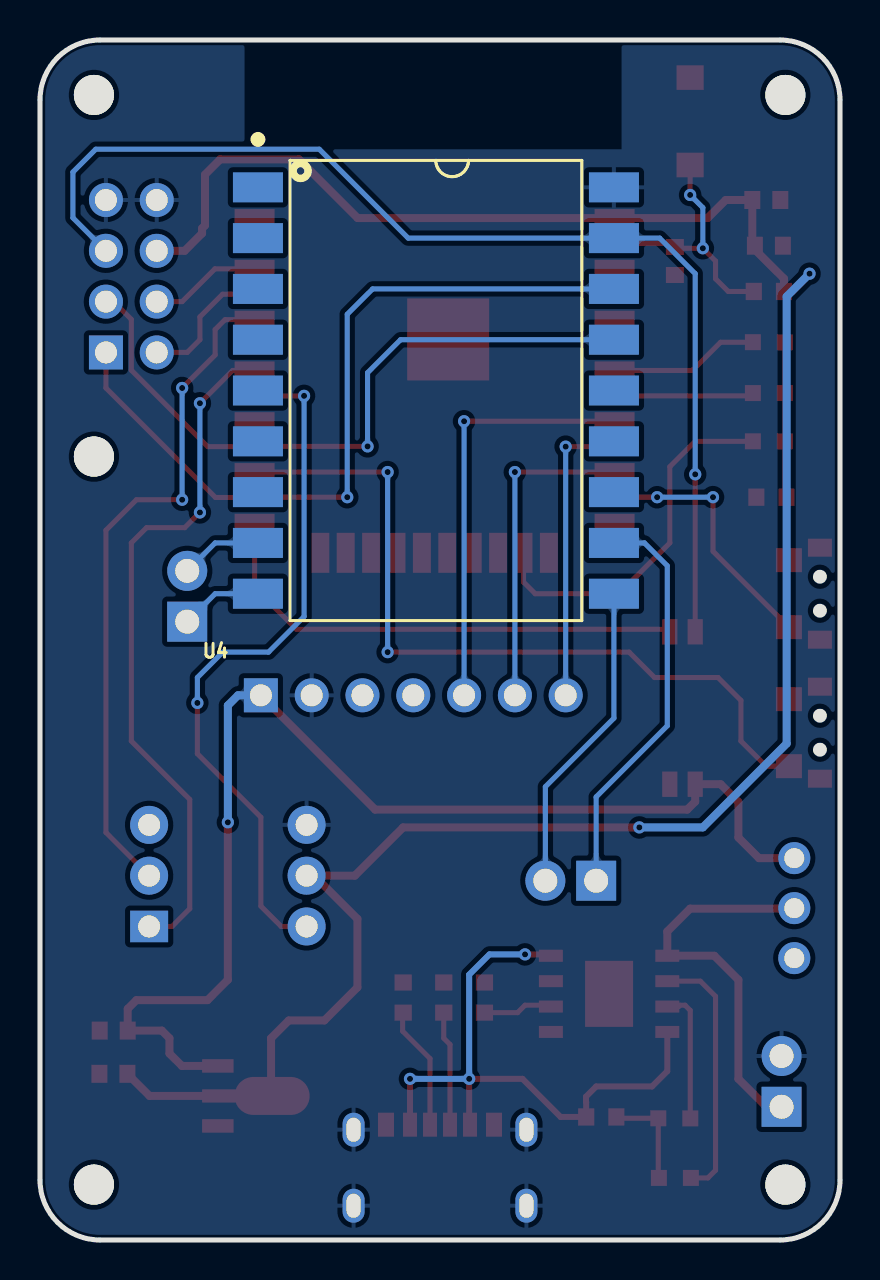
[diagram p5: board, bottom side, seen from below]

Outline 40 x 60 mm; copper layers: Top Layer, Bottom Layer. Coordinates in mm from the lower left corner of the outline.
Outline path: 0,57 0,3 arc(0.88,0.88) 3,0 37,0 arc(39.12,0.88) 40,3 40,57 arc(39.12,59.12) 37,60 3,60 arc(0.88,59.12) 0,57
Stack: Top Layer 0.035mm / Dielectric1 1.51mm FR4 er 4.5 / Bottom Layer 0.035mm

## Design rules (mm)
template: JLCPCB Capability(Two Layers Board)
spacing copperThickness1oz (default): track to track 0.102, other pairs 0.152 to 0.3
spacing copperThickness2oz: track to track 0.203, other pairs 0.152 to 0.3
track width copperThickness1oz (default): min 0.127, default 0.254, max 2.54
track width copperThickness2oz: min 0.203, default 0.254, max 2.54
differential pair differentialPair (default): width min 0.127, default 0.254, max 2.54; gap min 0.152, default 0.152
via viaSize (default): diameter min 0.5, default 0.61, max 10; hole min 0.3, default 0.305, max 6.3

## Placement (name value [footprint] x y rotation side)
BAT1  PZ254V-11-02P  [HDR-TH_2P-P2.54-V-M]  2.92 7.93 90 top
C1  100nF  [C0603]  3.56 49.71 180 top
C2  10uF  [C0603]  3.68 52 180 top
C3  10uF  [C0603]  8.25 48.95 90 top
C7  10uF  [C0603]  36.33 8.31 0 top
C8  10uF  [C0603]  36.31 10.47 180 top
ESP32  ESP32-WROOM-32-N4  [WIFIM-SMD_ESP32-WROOM-32-N4]  20.27 43.36 0 top
INMP441  -  [INMP441]  30.73 17.96 180 top
LED1  NCD0603R1  [LED0603-RD_RED]  3.56 44.89 0 top
LED2  NCD0603G1  [LED0603-RD]  3.56 42.35 0 top
LED3  NCD0603B1  [LED0603-RD]  3.56 39.93 0 top
LED4  NCD0603R1  [LED0603-RD_RED]  8.29 6.08 0 top
LED5  NCD0603G1  [LED0603-RD]  8.25 3.1 0 top
MAX98357  PZ254V-11-07P  [HDR-TH_7P-P2.54-V-M]  21.34 27.23 180 top
MIC2  PZ254V-11-02P  [HDR-TH_2P-P2.54-V-M]  13.46 17.96 0 top
R1  10kΩ  [R0603]  3.56 47.43 180 top
R2  1kΩ  [R0603]  3.43 37.14 180 top
R12  2.2kΩ  [R0603]  17.78 12.12 270 top
R15  1kΩ  [R0603]  11.94 6.15 180 top
R17  5.1kΩ  [R0603]  19.81 12.12 270 top
R18  5.1kΩ  [R0603]  21.84 12.12 270 top
SCREW6  -  [M2螺丝]  2.73 57.25 0 top
SCREW7  -  [M2螺丝]  37.3 57.25 0 top
SCREW8  -  [M2螺丝]  2.73 2.77 0 top
SCREW9  -  [M2螺丝]  37.3 39.17 0 top
SCREW10  -  [M2螺丝]  37.3 2.77 0 top
SPK2  PZ254V-11-02P  [HDR-TH_2P-P2.54-V-M]  32.64 32.19 90 top
SW1  SS-12D00-G3  [SW-TH_SS-12D00-G3]  2.29 16.59 90 top
SW11  TS24CA  [SW-SMD_TS24CA]  1.78 25.36 90 top
SW12  TS24CA  [SW-SMD_TS24CA]  1.78 32.31 90 top
SW13  DSHP02TS-S  [SW-SMD_DSHP02TS-S_1]  7.87 26.6 0 top
SW14  TS-1088R-02026  [SW-SMD_L3.9-W3.0-P4.45]  7.49 55.94 270 top
U3  TP4056  [ESOP-8_L4.9-W3.9-P1.27-LS6.0-BL-EP]  11.55 12.31 90 top
U4  -  [ASRPRO-CORE-1]  20.19 42.47 180 bottom
U5  PZ2.54-2*4  [HDR-TH_8P-P2.54-V-M-R2-C4-S2.54]  35.43 48.19 90 top
USBC2  TYPE-C 6P(073)  [TYPE-C-SMD_TYPE-C-6P_5]  20 3.74 0 top
V523  AMS1117-3.3V  [SOT-89-3_L4.5-W2.5-P1.50-LS4.2-BR]  29.75 7.2 0 top

## Footprints (pads in the part's own frame, mm; a bottom-side part is the same pattern mirrored in y, then rotated)
ASRPRO-CORE-1
  rect 2.5x1.5 smd: 1(-8.91,10.16) 2(-8.91,7.62) 3(-8.91,5.08) 4(-8.91,2.54) 5(-8.91,0) 6(-8.91,-2.54) 7(-8.91,-5.08) 8(-8.91,-7.62) 9(-8.91,-10.16) 10(8.89,-10.16) 11(8.89,-7.62) 12(8.89,-5.08) 13(8.89,-2.54) 14(8.89,0) 15(8.89,2.54) 16(8.89,5.08) 17(8.89,7.62) 18(8.89,10.16)
C0603
  rect 0.8x0.9 smd: 1(-0.7,0) 2(0.7,0)
ESOP-8_L4.9-W3.9-P1.27-LS6.0-BL-EP
  rect 0.6x1.2 smd: 1(-1.905,-2.909) 2(-0.635,-2.909) 3(0.635,-2.909) 4(1.905,-2.909) 5(1.905,2.909) 6(0.635,2.909) 7(-0.635,2.909) 8(-1.905,2.909)
  rect 3.3x2.4 smd: 9(0,0)
HDR-TH_2P-P2.54-V-M
  rect 2x2 hole 1.2: 1(-1.27,0)
  round 2 hole 1.2: 2(1.27,0)
HDR-TH_7P-P2.54-V-M
  rect 1.7x1.7 hole 1.1: 1(-7.62,0)
  round 1.7 hole 1.1: 2(-5.08,0) 3(-2.54,0) 4(0,0) 5(2.54,0) 6(5.08,0) 7(7.62,0)
HDR-TH_8P-P2.54-V-M-R2-C4-S2.54
  rect 1.7x1.7 hole 1.1: 1(-3.81,-1.27)
  round 1.7 hole 1.1: 2(-3.81,1.27) 3(-1.27,-1.27) 4(-1.27,1.27) 5(1.27,-1.27) 6(1.27,1.27) 7(3.81,-1.27) 8(3.81,1.27)
INMP441
  rect 1.9x1.575 hole 1.1: 1(-3.81,2.286)
  round 1.9 hole 1.1: 2(-3.81,-0.254) 3(-3.81,-2.794) 4(4.064,2.286) 5(4.064,-0.254) 6(4.064,-2.794)
LED0603-RD
  rect 0.8x0.8 smd: 1(-0.799,0) 2(0.799,0)
LED0603-RD_RED
  rect 0.8x0.8 smd: 1(-0.799,-0.004) 2(0.799,0.004)
M2螺丝
  round 2 hole 2: 1(0,0)
R0603
  rect 0.806x0.864 smd: 1(-0.753,0) 2(0.753,0)
SOT-89-3_L4.5-W2.5-P1.50-LS4.2-BR
  rect 1.575x0.672 smd: 1(1.356,-1.5) 3(1.356,1.5)
  custom 5.377x1.9 smd: 2(-1.356,0)
SW-SMD_DSHP02TS-S_1
  rect 0.76x1.27 smd: 1(-0.635,-3.81) 2(0.635,-3.81) 3(0.635,3.81) 4(-0.635,3.81)
SW-SMD_L3.9-W3.0-P4.45
  rect 1.23x1.36 smd: 1(-2.185,0) 2(2.185,0)
SW-SMD_TS24CA
  rect 0.9x1.2 smd: 1(-2.3,0.775) 2(2.3,0.775)
  rect 1.2x1.3 smd: 3(-1.675,-0.775) 4(1.675,-0.775)
SW-TH_SS-12D00-G3
  round 1.6 hole 1: 1(-2.5,0) 2(0,0) 3(2.5,0)
TYPE-C-SMD_TYPE-C-6P_5
  oval 1.1x1.7 hole 0.7x1.2: 7(-4.32,1.775) 7(-4.32,-2.025) 7(4.32,1.775) 7(4.32,-2.025)
  rect 0.7x1.2 smd: A5(-0.5,2.025) A9(1.5,2.025) B5(0.5,2.025) B9(-1.5,2.025)
  rect 0.8x1.2 smd: A12(2.7,2.025) B12(-2.7,2.025)
WIFIM-SMD_ESP32-WROOM-32-N4
  rect 2x0.9 smd: 1(-9,9.005) 2(-9,7.735) 3(-9,6.465) 4(-9,5.195) 5(-9,3.925) 6(-9,2.655) 7(-9,1.385) 8(-9,0.115) 9(-9,-1.155) 10(-9,-2.425) 11(-9,-3.695) 12(-9,-4.965) 13(-9,-6.235) 14(-9,-7.505) 25(9,-7.505) 26(9,-6.235) 27(9,-4.965) 28(9,-3.695) 29(9,-2.425) 30(9,-1.155) 31(9,0.115) 32(9,1.385) 33(9,2.655) 34(9,3.925) 35(9,5.195) 36(9,6.465) 37(9,7.735) 38(9,9.005)
  rect 0.9x2 smd: 15(-5.715,-9.005) 16(-4.445,-9.005) 17(-3.175,-9.005) 18(-1.905,-9.005) 19(-0.635,-9.005) 20(0.635,-9.005) 21(1.905,-9.005) 22(3.175,-9.005) 23(4.445,-9.005) 24(5.715,-9.005)
  rect 4.1x4.1 smd: 39(-0.68,1.665)

## Nets
As in the schematic.

Pads without a net: ESP32 4 5 6 7 14 17 18 19 20 21 22 23 24 29 32 36 37; INMP441 3; MAX98357 3 4; SCREW6 1; SCREW7 1; SCREW8 1; SCREW9 1; SCREW10 1; SW1 1; U4 1 2 3 4 5 6 7 12 13 14

## Via types
v1: diameter 0.61, hole 0.305, Top Layer to Bottom Layer, 24 vias

## Routing (per net, layer and track width the routed paths; a pad name or vN(x,y) marks a point on that pad's centre or on a via; arc(x,y) is an arc through that point)
3V3: length 114.9
  Top Layer w0.254: INMP441.5 26.29,18.22
  Top Layer w0.4: 35.63,8.31 34.52,7.2 V523.2 28.45,7.25 28.45,10.09 27.56,10.98 25.78,10.98 24.13,12.63 24.13,16.06 26.29,18.22 24.26,18.22 21.84,20.63 v1(10.03,20.63) ; v1(1.52,48.32) 2.41,47.43 R1.2 2.8,48.07 4.26,49.52 C1.1 4.38,49.84 4.38,52 5.72,52 6.62,51.1 ESP32.2 24.12,51.1 27.05,54.03 30.99,54.03 31.75,53.27 31.75,50.73 31.9,50.58 31.9,50.33 32.77,49.46 34.16,49.46
  Bottom Layer w0.4: v1(10.03,20.63) 6.86,20.63 2.67,24.82 2.67,47.17 v1(1.52,48.32)
5VIN: length 31.5
  Top Layer w0.3: U3.4 14.52,14.28 v1(15.75,14.28) ; USBC2.B9 18.54,5.81 v1(18.54,8.06) 15.88,8.06 13.97,6.15 R15.1 12.69,6.91 12.7,6.91 12.7,7.17 12.19,7.68 9.4,7.68 8.64,8.44 U3.8 ; USBC2.A9 v1(21.5,8.06)
  Bottom Layer w0.3: v1(21.5,8.06) v1(18.54,8.06) 18.54,13.26 17.53,14.28 v1(15.75,14.28)
VCC: length 60.6
  Top Layer w0.4: MAX98357.1 23.24,21.52 7.64,21.52 7.24,21.92 SW13.1 5.97,22.79 5.08,21.9 5.08,20.12 4.05,19.09 SW1.3 ; v1(30.61,20.88) 30.61,13.01 31.62,11.99 35.18,11.99 35.61,11.56 C8.2 33.91,10.47 33.53,10.09 33.53,9.33 32.9,8.7 V523.3
  Bottom Layer w0.4: v1(30.61,20.88) 30.61,26.73 30.1,27.23 MAX98357.1
ASRPRO_VCC: length 56.7
  Top Layer w0.254: SW13.4 v1(7.24,38.28)
  Bottom Layer w0.254: v1(7.24,38.28) 7.24,48.32 9.02,50.09 U4.17 21.59,50.09 26.03,54.54 37.21,54.54 38.35,53.4 38.35,51.11 36.7,49.46
BAT+: length 19.8
  Top Layer w0.4: SW1.2 2.31,16.57 7.49,16.57 8.64,15.42 U3.5 6.28,14.21 5.08,13.01 5.08,8.06 3.68,6.66 BAT1.1
EN: length 12.9
  Top Layer w0.254: ESP32.3 8.43,49.83 C3.2 8.19,49.59 v1(6.86,49.59) 6.22,48.95 6.22,48.06 5.59,47.43 R1.1 ; v1(7.49,52.25) SW14.2
  Bottom Layer w0.254: v1(6.86,49.59) 6.86,51.62 v1(7.49,52.25)
IO0: length 24.9
  Top Layer w0.254: SW13.3 8.64,30.54 27.18,30.54 29.27,32.63 ESP32.25
IO4: length 39.1
  Top Layer w0.254: v1(24.64,37.14) 29.26,37.14 ESP32.26 31.23,37.13 36.7,42.6 36.7,44.38
  Bottom Layer w0.254: U4.16 23.37,47.55 24.64,46.28 v1(24.64,37.14)
IO13: length 18.6
  Top Layer w0.254: LED3.2 7.24,39.93 8.51,38.66 8.51,34.85 11.05,32.31 15.24,32.31 15.82,32.9 ESP32.16
IO14: length 13
  Top Layer w0.254: ESP32.13 11.26,37.14 v1(9.14,37.14) ; v1(6.35,37.14) 6.35,34.44 SW12.3
  Bottom Layer w0.254: v1(6.35,37.14) v1(9.14,37.14)
IO16: length 39.3
  Top Layer w0.254: ESP32.27 v1(22.62,38.4) ; SW11.3 3.69,23.69 4.95,24.95 4.95,26.98 6.1,28.12 9.27,28.12 10.54,29.39 v1(22.62,29.39)
  Bottom Layer w0.254: v1(22.62,38.4) v1(22.62,29.39)
IO17: length 34.3
  Top Layer w0.254: v1(23.62,39.68) 29.26,39.68 ESP32.28 31.61,39.67 35.43,43.49 35.43,46.03 36.32,46.92 U5.3
  Bottom Layer w0.254: v1(23.62,39.68) 23.62,43.36 21.97,45.01 U4.15
IO18: length 35.6
  Top Layer w0.254: v1(32.13,26.85) 32.13,24.31 28.96,21.14 28.96,16.69 27.94,15.68 INMP441.4 ; ESP32.30 v1(26.8,42.21)
  Bottom Layer w0.254: v1(26.8,42.21) 26.8,31.17 28.57,29.39 30.86,29.39 32.13,28.12 v1(32.13,26.85)
IO19: length 34.8
  Top Layer w0.254: INMP441.1 33.4,15.68 32.51,16.57 32.51,22.03 35.43,24.95 35.43,34.85 34.67,35.62 32.77,35.62 v1(32,36.38) ; v1(32,41.84) 30.37,43.48 ESP32.31
  Bottom Layer w0.254: v1(32,41.84) v1(32,36.38)
IO21: length 34
  Top Layer w0.254: ESP32.33 30.75,46.02 31.24,45.52 31.24,44.25 v1(32.89,42.6) ; v1(32.89,37.01) 35.18,37.01 36.7,35.49 36.7,20.38 INMP441.2
  Bottom Layer w0.254: v1(32.89,42.6) v1(32.89,37.01)
IO25: length 21.2
  Top Layer w0.254: ESP32.10 v1(18.8,40.94)
  Bottom Layer w0.254: v1(18.8,40.94) MAX98357.5
IO26: length 14.9
  Top Layer w0.254: ESP32.11 v1(13.72,39.67)
  Bottom Layer w0.254: v1(13.72,39.67) MAX98357.7
IO27: length 16.2
  Top Layer w0.254: ESP32.12 v1(16.26,38.4)
  Bottom Layer w0.254: v1(16.26,38.4) MAX98357.6
IO32: length 7.5
  Top Layer w0.254: LED1.2 4.36,44.89 5.97,44.89 7.38,43.48 ESP32.8
IO33: length 7
  Top Layer w0.254: ESP32.9 4.49,42.21 LED2.2
MIC+: length 20.4
  Bottom Layer w0.254: U4.11 9.78,34.85 8.64,33.71 8.64,25.71 12.19,22.15 MIC2.1
MIC-: length 15.8
  Bottom Layer w0.254: U4.10 11.3,26.09 14.73,22.66 MIC2.2
RXD: length 6.8
  Top Layer w0.254: ESP32.34 30.87,47.29 32,46.16 32,45.01 32.64,44.38 34.16,44.38
SPK+: length 4.1
  Bottom Layer w0.254: U4.9 31.24,32.31 SPK2.1
SPK-: length 4.1
  Bottom Layer w0.254: U4.8 31.24,34.85 SPK2.2
TXD: length 5.6
  Top Layer w0.254: ESP32.35 31.25,48.56 32.89,46.92 34.16,46.92
$3N1069: length 7.8
  Top Layer w0.254: LED1.1 LED2.1 LED3.1 2.76,37.22 R2.2
$4N4694: length 6.2
  Top Layer w0.254: USBC2.B5 20.5,9.07 21.87,10.44 21.87,11.34 R18.2
$4N4695: length 5.7
  Top Layer w0.254: USBC2.A5 19.5,9.78 19.81,10.09 R17.2
$4N4957: length 6.7
  Top Layer w0.254: LED4.1 7.49,11.48 7.75,11.74 8,11.74 8.07,11.67 U3.7
$4N4958: length 12.8
  Top Layer w0.254: LED5.1 6.6,3.1 6.22,3.49 6.22,12.18 6.99,12.94 U3.6
$4N4959: length 5.1
  Top Layer w0.254: LED5.2 9.09,3.14 LED4.2 11.12,6.09 R15.2
$4N4961: length 3.5
  Top Layer w0.254: R12.2 16.12,11.37 15.75,11.74 14.52,11.74 U3.2

## Copper pours and planes (outline as drawn; the poured copper is in the pictures)
GND on Top Layer: -0.63,60.64 10.92,60.64 10.92,54.28 29.72,54.28 29.72,60.64 39.5,60.64 40.77,59.36 40.77,0.69 39.12,-0.96 1.78,-0.96 1.65,-1.09 -0.63,1.2
GND on Bottom Layer: -1.14,60.76 10.79,60.76 10.92,60.89 10.92,54.54 29.77,54.54 29.77,60.45 29.72,60.51 40.77,60.51 40.89,60.64 40.89,-0.83 40.39,-1.34 1.4,-1.34 1.27,-1.47 -1.14,0.94

Small or netless copper shapes (teardrops, artwork), in the pictures only: 113 on Top Layer, 42 on Bottom Layer

## Text on the board
Top Silkscreen Layer: 18 | G | V | - | + | esp32 | T | R | 21 | 19 | 3 | asrpro | 17 | 4 | asr vcc | down|run | ASR | RST | VCC-SW
